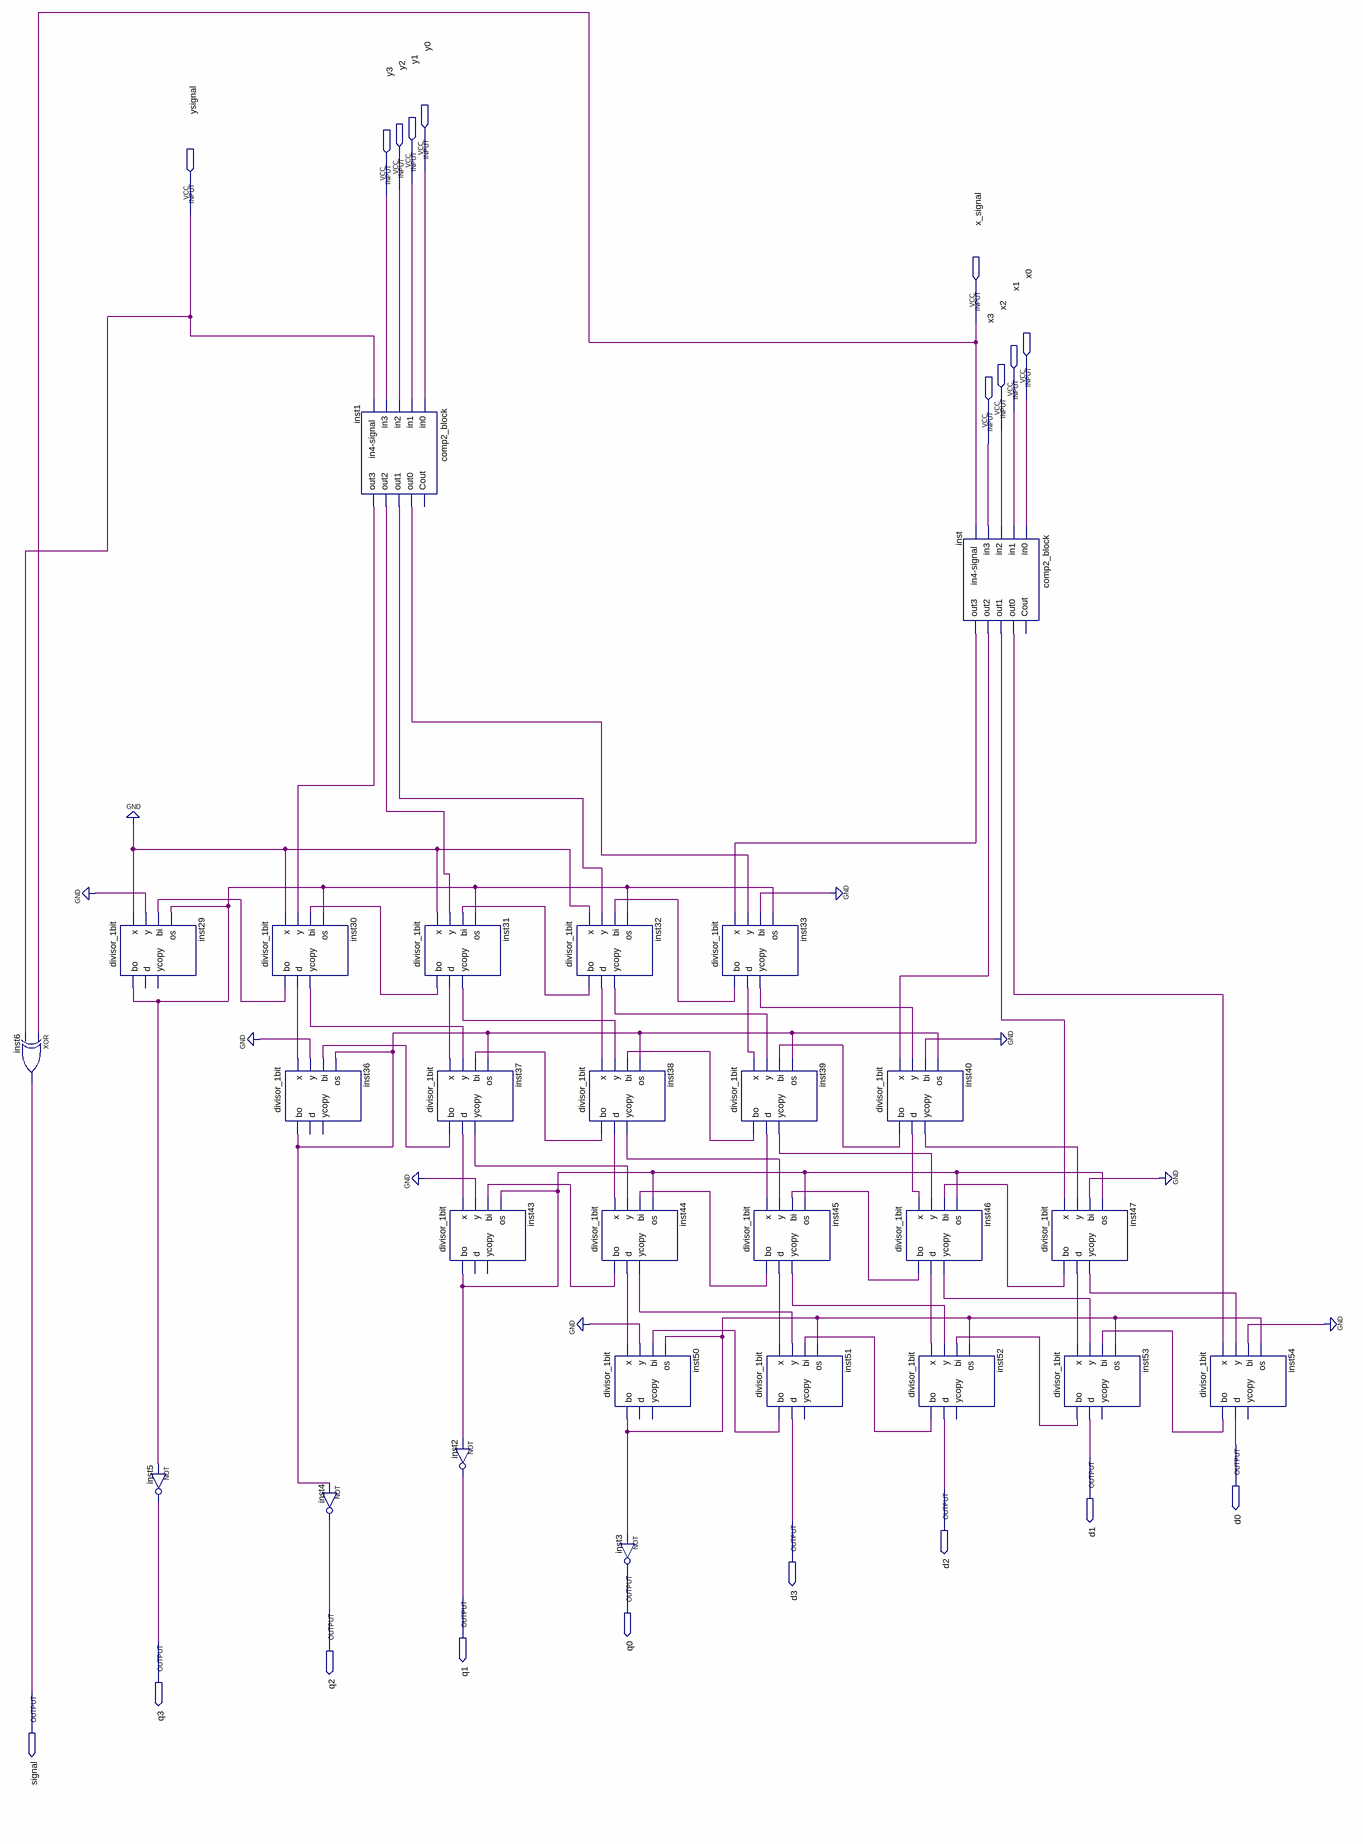
[diagram p0: schematic sheet]
// Quartus schematic divisor_complete1.bdf as structural Verilog: 27 symbols, 19 pins
module divisor_complete1 (
  input  y0,
  input  y1,
  input  y2,
  input  y3,
  input  ysignal,
  input  x_signal,
  input  x0,
  input  x1,
  input  x2,
  input  x3,
  output d0,
  output d1,
  output d2,
  output d3,
  output q0,
  output q1,
  output q2,
  output q3,
  output signal
);

  wire inst1_out0, inst1_out1, inst1_out2, inst1_out3, inst29_bo, inst30_bo, inst30_d, inst30_ycopy,
       inst31_bo, inst31_d, inst31_ycopy, inst32_bo, inst32_d, inst32_ycopy, inst33_bo, inst33_d,
       inst33_ycopy, inst36_bo, inst37_bo, inst37_d, inst37_ycopy, inst38_bo, inst38_d, inst38_ycopy,
       inst39_bo, inst39_d, inst39_ycopy, inst40_bo, inst40_d, inst40_ycopy, inst43_bo, inst44_bo, inst44_d,
       inst44_ycopy, inst45_bo, inst45_d, inst45_ycopy, inst46_bo, inst46_d, inst46_ycopy, inst47_bo,
       inst47_d, inst47_ycopy, inst50_bo, inst51_bo, inst52_bo, inst53_bo, inst54_bo, inst_out0, inst_out1,
       inst_out2, inst_out3;

  xor inst6 (signal, x_signal, ysignal);
  divisor_1bit inst29 (.x(1'b0), .y(1'b0), .bi(inst30_bo), .os(inst29_bo), .bo(inst29_bo));  // open: d, ycopy
  not inst5 (q3, inst29_bo);
  divisor_1bit inst30 (
    .x(1'b0), .y(inst1_out3), .bi(inst31_bo), .os(inst29_bo), .bo(inst30_bo), .d(inst30_d),
    .ycopy(inst30_ycopy));
  divisor_1bit inst36 (.x(inst30_d), .y(1'b0), .bi(inst37_bo), .os(inst36_bo), .bo(inst36_bo));  // open: d, ycopy
  not inst4 (q2, inst36_bo);
  comp2_block inst1 (
    .in0(y0), .in1(y1), .in2(y2), .in3(y3), .\in4-signal (ysignal), .out0(inst1_out0), .out1(inst1_out1),
    .out2(inst1_out2), .out3(inst1_out3));  // open: Cout
  divisor_1bit inst31 (
    .x(1'b0), .y(inst1_out2), .bi(inst32_bo), .os(inst29_bo), .bo(inst31_bo), .d(inst31_d),
    .ycopy(inst31_ycopy));
  divisor_1bit inst37 (
    .x(inst31_d), .y(inst30_ycopy), .bi(inst38_bo), .os(inst36_bo), .bo(inst37_bo), .d(inst37_d),
    .ycopy(inst37_ycopy));
  divisor_1bit inst43 (.x(inst37_d), .y(1'b0), .bi(inst44_bo), .os(inst43_bo), .bo(inst43_bo));  // open: d, ycopy
  not inst2 (q1, inst43_bo);
  divisor_1bit inst32 (
    .x(1'b0), .y(inst1_out1), .bi(inst33_bo), .os(inst29_bo), .bo(inst32_bo), .d(inst32_d),
    .ycopy(inst32_ycopy));
  divisor_1bit inst38 (
    .x(inst32_d), .y(inst31_ycopy), .bi(inst39_bo), .os(inst36_bo), .bo(inst38_bo), .d(inst38_d),
    .ycopy(inst38_ycopy));
  divisor_1bit inst44 (
    .x(inst38_d), .y(inst37_ycopy), .bi(inst45_bo), .os(inst43_bo), .bo(inst44_bo), .d(inst44_d),
    .ycopy(inst44_ycopy));
  divisor_1bit inst50 (.x(inst44_d), .y(1'b0), .bi(inst51_bo), .os(inst50_bo), .bo(inst50_bo));  // open: d, ycopy
  not inst3 (q0, inst50_bo);
  divisor_1bit inst33 (
    .x(inst_out3), .y(inst1_out0), .bi(1'b0), .os(inst29_bo), .bo(inst33_bo), .d(inst33_d),
    .ycopy(inst33_ycopy));
  divisor_1bit inst39 (
    .x(inst33_d), .y(inst32_ycopy), .bi(inst40_bo), .os(inst36_bo), .bo(inst39_bo), .d(inst39_d),
    .ycopy(inst39_ycopy));
  divisor_1bit inst45 (
    .x(inst39_d), .y(inst38_ycopy), .bi(inst46_bo), .os(inst43_bo), .bo(inst45_bo), .d(inst45_d),
    .ycopy(inst45_ycopy));
  divisor_1bit inst51 (
    .x(inst45_d), .y(inst44_ycopy), .bi(inst52_bo), .os(inst50_bo), .bo(inst51_bo), .d(d3));  // open: ycopy
  divisor_1bit inst40 (
    .x(inst_out2), .y(inst33_ycopy), .bi(1'b0), .os(inst36_bo), .bo(inst40_bo), .d(inst40_d),
    .ycopy(inst40_ycopy));
  divisor_1bit inst46 (
    .x(inst40_d), .y(inst39_ycopy), .bi(inst47_bo), .os(inst43_bo), .bo(inst46_bo), .d(inst46_d),
    .ycopy(inst46_ycopy));
  divisor_1bit inst52 (
    .x(inst46_d), .y(inst45_ycopy), .bi(inst53_bo), .os(inst50_bo), .bo(inst52_bo), .d(d2));  // open: ycopy
  comp2_block inst (
    .in0(x0), .in1(x1), .in2(x2), .in3(x3), .\in4-signal (x_signal), .out0(inst_out0), .out1(inst_out1),
    .out2(inst_out2), .out3(inst_out3));  // open: Cout
  divisor_1bit inst47 (
    .x(inst_out1), .y(inst40_ycopy), .bi(1'b0), .os(inst43_bo), .bo(inst47_bo), .d(inst47_d),
    .ycopy(inst47_ycopy));
  divisor_1bit inst53 (
    .x(inst47_d), .y(inst46_ycopy), .bi(inst54_bo), .os(inst50_bo), .bo(inst53_bo), .d(d1));  // open: ycopy
  divisor_1bit inst54 (
    .x(inst_out0), .y(inst47_ycopy), .bi(1'b0), .os(inst50_bo), .bo(inst54_bo), .d(d0));  // open: ycopy

  // Other names for the same wires on the sheet: akokoakaoo = ysignal
endmodule
